# EAGLE design pcb (EAGLE 9.6.2)
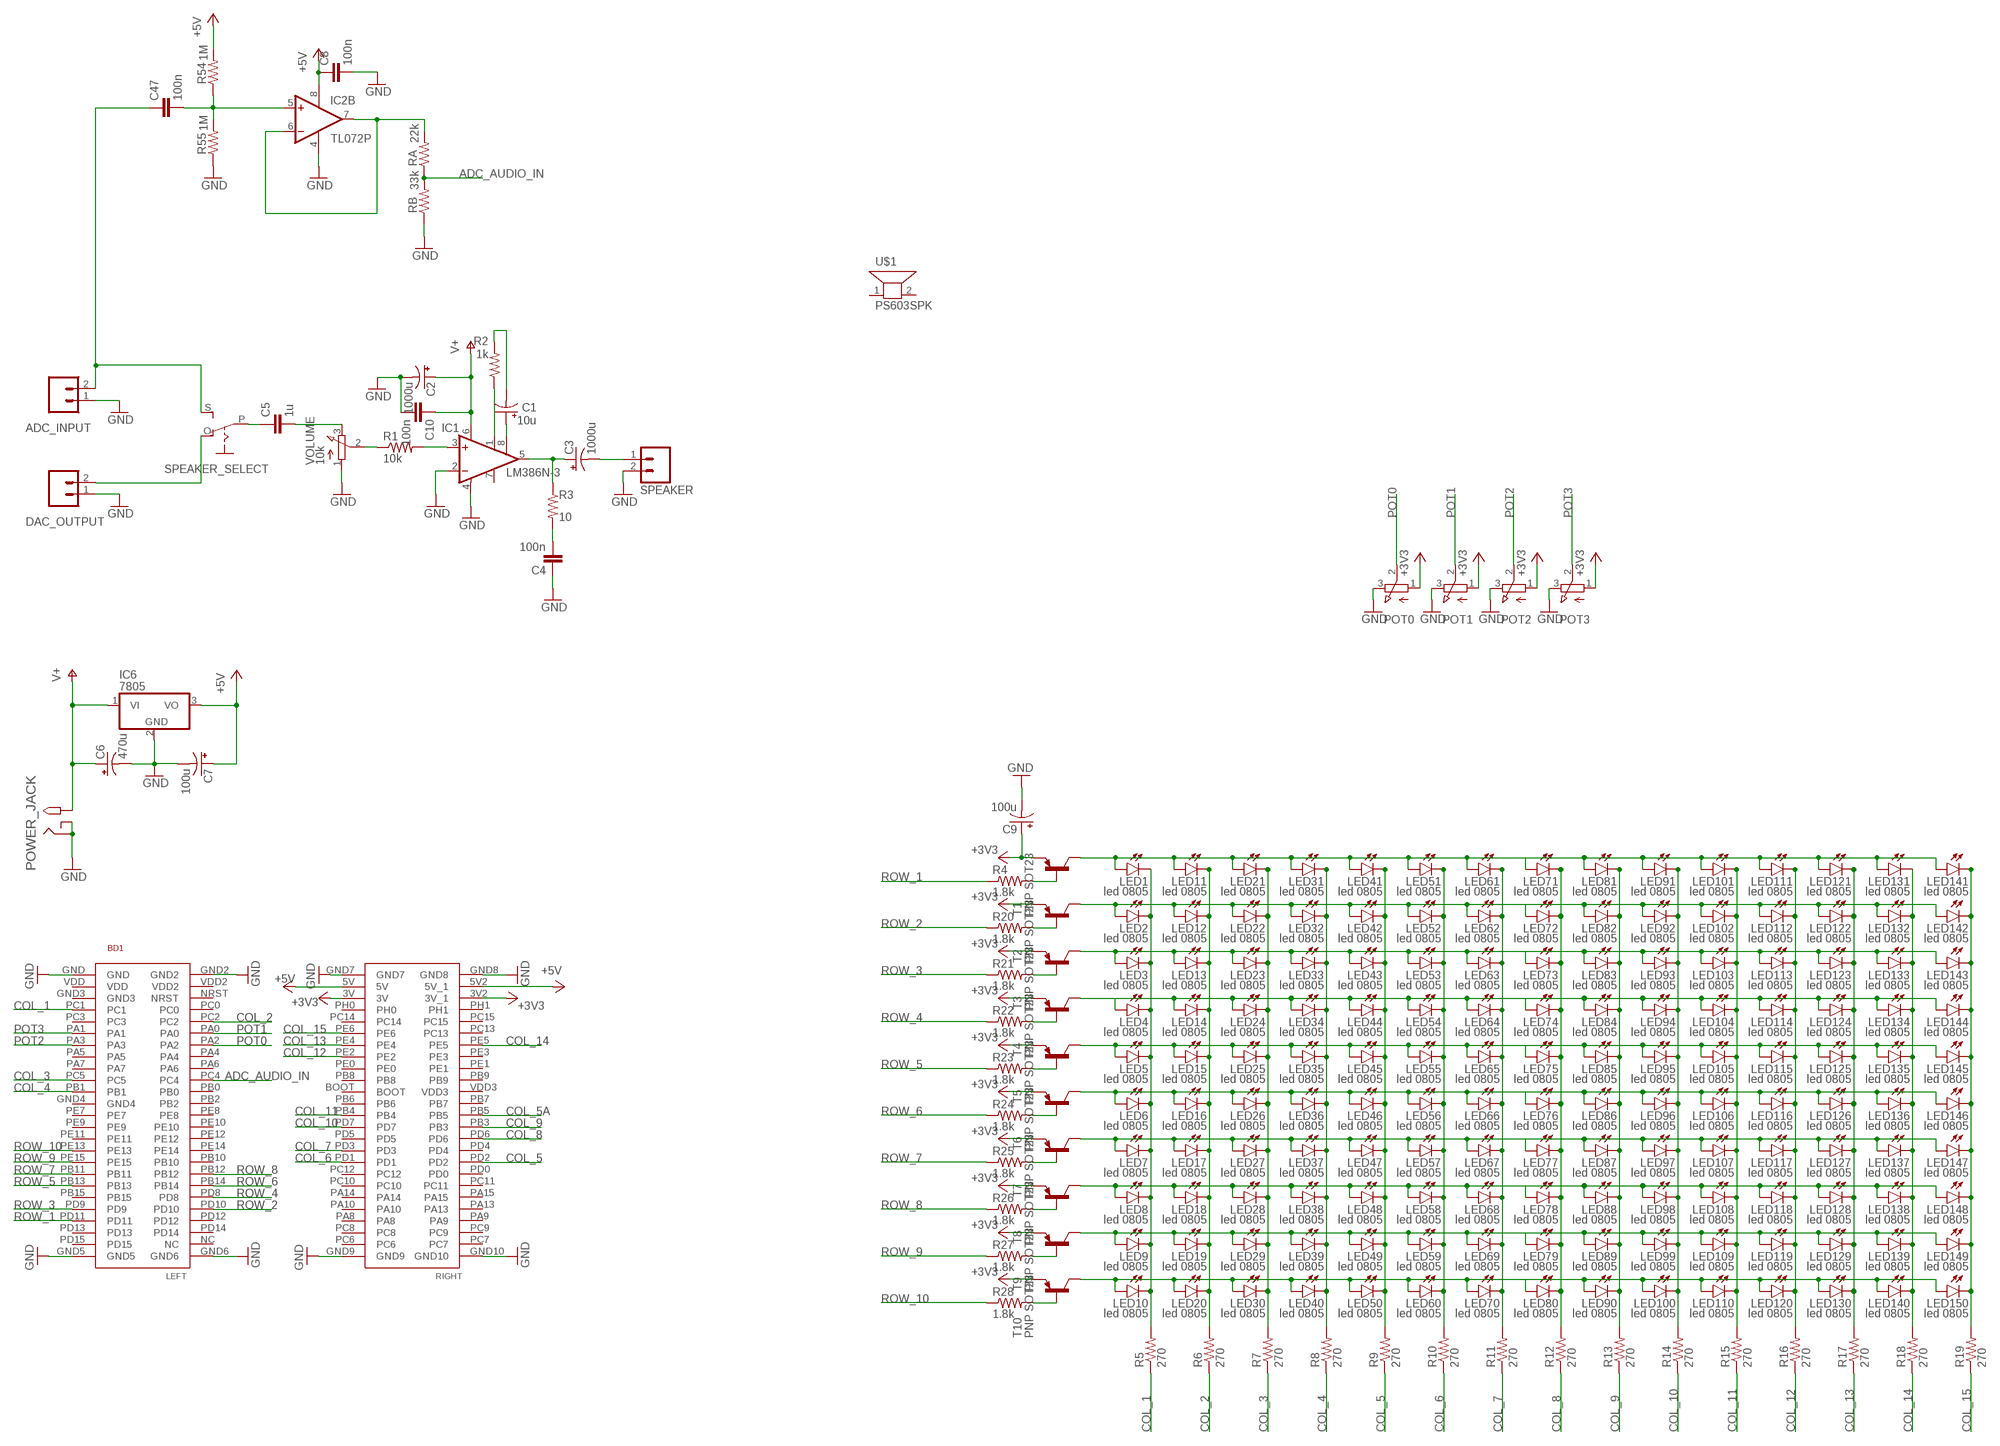
[diagram p0: schematic, sheet 1]

## Parts
ADC_INPUT  M02  [02P]
BD1  STM32F4-DISCOVERY  [STM32F407VG]
C1  10u  CPOL-USE5-6  [E5-6]
C2  1000u  CPOL-USE5-13  [E5-13]
C3  1000u  CPOL-USE5-13  [E5-13]
C4  100n  C5/3.5  [C5B3.5]
C5  1u  C-EU050-035X075  [C050-035X075]
C6  470u  CPOL-USE5-6  [E5-6]
C7  100u  CPOL-USE5-6  [E5-6]
C8  100n  C-EUC0805  [C0805]
C9  100u  CPOL-USE5-6  [E5-6]
C10  100n  C-EUC0805  [C0805]
C47  100n  C5/3.5  [C5B3.5]
DAC_OUTPUT  M02  [02P]
IC1  LM386N-3  [DIL08]
IC2  TL072P  [DIL08]
IC6  7805  7805T  [TO220H]
LED1  led 0805  LEDCHIPLED_0805  [CHIPLED_0805]
LED2  led 0805  LEDCHIPLED_0805  [CHIPLED_0805]
LED3  led 0805  LEDCHIPLED_0805  [CHIPLED_0805]
LED4  led 0805  LEDCHIPLED_0805  [CHIPLED_0805]
LED5  led 0805  LEDCHIPLED_0805  [CHIPLED_0805]
LED6  led 0805  LEDCHIPLED_0805  [CHIPLED_0805]
LED7  led 0805  LEDCHIPLED_0805  [CHIPLED_0805]
LED8  led 0805  LEDCHIPLED_0805  [CHIPLED_0805]
LED9  led 0805  LEDCHIPLED_0805  [CHIPLED_0805]
LED10  led 0805  LEDCHIPLED_0805  [CHIPLED_0805]
LED11  led 0805  LEDCHIPLED_0805  [CHIPLED_0805]
LED12  led 0805  LEDCHIPLED_0805  [CHIPLED_0805]
LED13  led 0805  LEDCHIPLED_0805  [CHIPLED_0805]
LED14  led 0805  LEDCHIPLED_0805  [CHIPLED_0805]
LED15  led 0805  LEDCHIPLED_0805  [CHIPLED_0805]
LED16  led 0805  LEDCHIPLED_0805  [CHIPLED_0805]
LED17  led 0805  LEDCHIPLED_0805  [CHIPLED_0805]
LED18  led 0805  LEDCHIPLED_0805  [CHIPLED_0805]
LED19  led 0805  LEDCHIPLED_0805  [CHIPLED_0805]
LED20  led 0805  LEDCHIPLED_0805  [CHIPLED_0805]
LED21  led 0805  LEDCHIPLED_0805  [CHIPLED_0805]
LED22  led 0805  LEDCHIPLED_0805  [CHIPLED_0805]
LED23  led 0805  LEDCHIPLED_0805  [CHIPLED_0805]
LED24  led 0805  LEDCHIPLED_0805  [CHIPLED_0805]
LED25  led 0805  LEDCHIPLED_0805  [CHIPLED_0805]
LED26  led 0805  LEDCHIPLED_0805  [CHIPLED_0805]
LED27  led 0805  LEDCHIPLED_0805  [CHIPLED_0805]
LED28  led 0805  LEDCHIPLED_0805  [CHIPLED_0805]
LED29  led 0805  LEDCHIPLED_0805  [CHIPLED_0805]
LED30  led 0805  LEDCHIPLED_0805  [CHIPLED_0805]
LED31  led 0805  LEDCHIPLED_0805  [CHIPLED_0805]
LED32  led 0805  LEDCHIPLED_0805  [CHIPLED_0805]
LED33  led 0805  LEDCHIPLED_0805  [CHIPLED_0805]
LED34  led 0805  LEDCHIPLED_0805  [CHIPLED_0805]
LED35  led 0805  LEDCHIPLED_0805  [CHIPLED_0805]
LED36  led 0805  LEDCHIPLED_0805  [CHIPLED_0805]
LED37  led 0805  LEDCHIPLED_0805  [CHIPLED_0805]
LED38  led 0805  LEDCHIPLED_0805  [CHIPLED_0805]
LED39  led 0805  LEDCHIPLED_0805  [CHIPLED_0805]
LED40  led 0805  LEDCHIPLED_0805  [CHIPLED_0805]
LED41  led 0805  LEDCHIPLED_0805  [CHIPLED_0805]
LED42  led 0805  LEDCHIPLED_0805  [CHIPLED_0805]
LED43  led 0805  LEDCHIPLED_0805  [CHIPLED_0805]
LED44  led 0805  LEDCHIPLED_0805  [CHIPLED_0805]
LED45  led 0805  LEDCHIPLED_0805  [CHIPLED_0805]
LED46  led 0805  LEDCHIPLED_0805  [CHIPLED_0805]
LED47  led 0805  LEDCHIPLED_0805  [CHIPLED_0805]
LED48  led 0805  LEDCHIPLED_0805  [CHIPLED_0805]
LED49  led 0805  LEDCHIPLED_0805  [CHIPLED_0805]
LED50  led 0805  LEDCHIPLED_0805  [CHIPLED_0805]
LED51  led 0805  LEDCHIPLED_0805  [CHIPLED_0805]
LED52  led 0805  LEDCHIPLED_0805  [CHIPLED_0805]
LED53  led 0805  LEDCHIPLED_0805  [CHIPLED_0805]
LED54  led 0805  LEDCHIPLED_0805  [CHIPLED_0805]
LED55  led 0805  LEDCHIPLED_0805  [CHIPLED_0805]
LED56  led 0805  LEDCHIPLED_0805  [CHIPLED_0805]
LED57  led 0805  LEDCHIPLED_0805  [CHIPLED_0805]
LED58  led 0805  LEDCHIPLED_0805  [CHIPLED_0805]
LED59  led 0805  LEDCHIPLED_0805  [CHIPLED_0805]
LED60  led 0805  LEDCHIPLED_0805  [CHIPLED_0805]
LED61  led 0805  LEDCHIPLED_0805  [CHIPLED_0805]
LED62  led 0805  LEDCHIPLED_0805  [CHIPLED_0805]
LED63  led 0805  LEDCHIPLED_0805  [CHIPLED_0805]
LED64  led 0805  LEDCHIPLED_0805  [CHIPLED_0805]
LED65  led 0805  LEDCHIPLED_0805  [CHIPLED_0805]
LED66  led 0805  LEDCHIPLED_0805  [CHIPLED_0805]
LED67  led 0805  LEDCHIPLED_0805  [CHIPLED_0805]
LED68  led 0805  LEDCHIPLED_0805  [CHIPLED_0805]
LED69  led 0805  LEDCHIPLED_0805  [CHIPLED_0805]
LED70  led 0805  LEDCHIPLED_0805  [CHIPLED_0805]
LED71  led 0805  LEDCHIPLED_0805  [CHIPLED_0805]
LED72  led 0805  LEDCHIPLED_0805  [CHIPLED_0805]
LED73  led 0805  LEDCHIPLED_0805  [CHIPLED_0805]
LED74  led 0805  LEDCHIPLED_0805  [CHIPLED_0805]
LED75  led 0805  LEDCHIPLED_0805  [CHIPLED_0805]
LED76  led 0805  LEDCHIPLED_0805  [CHIPLED_0805]
LED77  led 0805  LEDCHIPLED_0805  [CHIPLED_0805]
LED78  led 0805  LEDCHIPLED_0805  [CHIPLED_0805]
LED79  led 0805  LEDCHIPLED_0805  [CHIPLED_0805]
LED80  led 0805  LEDCHIPLED_0805  [CHIPLED_0805]
LED81  led 0805  LEDCHIPLED_0805  [CHIPLED_0805]
LED82  led 0805  LEDCHIPLED_0805  [CHIPLED_0805]
LED83  led 0805  LEDCHIPLED_0805  [CHIPLED_0805]
LED84  led 0805  LEDCHIPLED_0805  [CHIPLED_0805]
LED85  led 0805  LEDCHIPLED_0805  [CHIPLED_0805]
LED86  led 0805  LEDCHIPLED_0805  [CHIPLED_0805]
LED87  led 0805  LEDCHIPLED_0805  [CHIPLED_0805]
LED88  led 0805  LEDCHIPLED_0805  [CHIPLED_0805]
LED89  led 0805  LEDCHIPLED_0805  [CHIPLED_0805]
LED90  led 0805  LEDCHIPLED_0805  [CHIPLED_0805]
LED91  led 0805  LEDCHIPLED_0805  [CHIPLED_0805]
LED92  led 0805  LEDCHIPLED_0805  [CHIPLED_0805]
LED93  led 0805  LEDCHIPLED_0805  [CHIPLED_0805]
LED94  led 0805  LEDCHIPLED_0805  [CHIPLED_0805]
LED95  led 0805  LEDCHIPLED_0805  [CHIPLED_0805]
LED96  led 0805  LEDCHIPLED_0805  [CHIPLED_0805]
LED97  led 0805  LEDCHIPLED_0805  [CHIPLED_0805]
LED98  led 0805  LEDCHIPLED_0805  [CHIPLED_0805]
LED99  led 0805  LEDCHIPLED_0805  [CHIPLED_0805]
LED100  led 0805  LEDCHIPLED_0805  [CHIPLED_0805]
LED101  led 0805  LEDCHIPLED_0805  [CHIPLED_0805]
LED102  led 0805  LEDCHIPLED_0805  [CHIPLED_0805]
LED103  led 0805  LEDCHIPLED_0805  [CHIPLED_0805]
LED104  led 0805  LEDCHIPLED_0805  [CHIPLED_0805]
LED105  led 0805  LEDCHIPLED_0805  [CHIPLED_0805]
LED106  led 0805  LEDCHIPLED_0805  [CHIPLED_0805]
LED107  led 0805  LEDCHIPLED_0805  [CHIPLED_0805]
LED108  led 0805  LEDCHIPLED_0805  [CHIPLED_0805]
LED109  led 0805  LEDCHIPLED_0805  [CHIPLED_0805]
LED110  led 0805  LEDCHIPLED_0805  [CHIPLED_0805]
LED111  led 0805  LEDCHIPLED_0805  [CHIPLED_0805]
LED112  led 0805  LEDCHIPLED_0805  [CHIPLED_0805]
LED113  led 0805  LEDCHIPLED_0805  [CHIPLED_0805]
LED114  led 0805  LEDCHIPLED_0805  [CHIPLED_0805]
LED115  led 0805  LEDCHIPLED_0805  [CHIPLED_0805]
LED116  led 0805  LEDCHIPLED_0805  [CHIPLED_0805]
LED117  led 0805  LEDCHIPLED_0805  [CHIPLED_0805]
LED118  led 0805  LEDCHIPLED_0805  [CHIPLED_0805]
LED119  led 0805  LEDCHIPLED_0805  [CHIPLED_0805]
LED120  led 0805  LEDCHIPLED_0805  [CHIPLED_0805]
LED121  led 0805  LEDCHIPLED_0805  [CHIPLED_0805]
LED122  led 0805  LEDCHIPLED_0805  [CHIPLED_0805]
LED123  led 0805  LEDCHIPLED_0805  [CHIPLED_0805]
LED124  led 0805  LEDCHIPLED_0805  [CHIPLED_0805]
LED125  led 0805  LEDCHIPLED_0805  [CHIPLED_0805]
LED126  led 0805  LEDCHIPLED_0805  [CHIPLED_0805]
LED127  led 0805  LEDCHIPLED_0805  [CHIPLED_0805]
LED128  led 0805  LEDCHIPLED_0805  [CHIPLED_0805]
LED129  led 0805  LEDCHIPLED_0805  [CHIPLED_0805]
LED130  led 0805  LEDCHIPLED_0805  [CHIPLED_0805]
LED131  led 0805  LEDCHIPLED_0805  [CHIPLED_0805]
LED132  led 0805  LEDCHIPLED_0805  [CHIPLED_0805]
LED133  led 0805  LEDCHIPLED_0805  [CHIPLED_0805]
LED134  led 0805  LEDCHIPLED_0805  [CHIPLED_0805]
LED135  led 0805  LEDCHIPLED_0805  [CHIPLED_0805]
LED136  led 0805  LEDCHIPLED_0805  [CHIPLED_0805]
LED137  led 0805  LEDCHIPLED_0805  [CHIPLED_0805]
LED138  led 0805  LEDCHIPLED_0805  [CHIPLED_0805]
LED139  led 0805  LEDCHIPLED_0805  [CHIPLED_0805]
LED140  led 0805  LEDCHIPLED_0805  [CHIPLED_0805]
LED141  led 0805  LEDCHIPLED_0805  [CHIPLED_0805]
LED142  led 0805  LEDCHIPLED_0805  [CHIPLED_0805]
LED143  led 0805  LEDCHIPLED_0805  [CHIPLED_0805]
LED144  led 0805  LEDCHIPLED_0805  [CHIPLED_0805]
LED145  led 0805  LEDCHIPLED_0805  [CHIPLED_0805]
LED146  led 0805  LEDCHIPLED_0805  [CHIPLED_0805]
LED147  led 0805  LEDCHIPLED_0805  [CHIPLED_0805]
LED148  led 0805  LEDCHIPLED_0805  [CHIPLED_0805]
LED149  led 0805  LEDCHIPLED_0805  [CHIPLED_0805]
LED150  led 0805  LEDCHIPLED_0805  [CHIPLED_0805]
POT0  3RP/1610N  [3RP/1610N]
POT1  3RP/1610N  [3RP/1610N]
POT2  3RP/1610N  [3RP/1610N]
POT3  3RP/1610N  [3RP/1610N]
POWER_JACK  2.1MMJACKTHM  [PJ-102A]
R1  10k  R-US_0207/10  [0207/10]
R2  1k  R-US_0207/10  [0207/10]
R3  10  R-US_0207/10  [0207/10]
R4  1.8k  R-US_R0805  [R0805]
R5  270  R-US_R0805  [R0805]
R6  270  R-US_R0805  [R0805]
R7  270  R-US_R0805  [R0805]
R8  270  R-US_R0805  [R0805]
R9  270  R-US_R0805  [R0805]
R10  270  R-US_R0805  [R0805]
R11  270  R-US_R0805  [R0805]
R12  270  R-US_R0805  [R0805]
R13  270  R-US_R0805  [R0805]
R14  270  R-US_R0805  [R0805]
R15  270  R-US_R0805  [R0805]
R16  270  R-US_R0805  [R0805]
R17  270  R-US_R0805  [R0805]
R18  270  R-US_R0805  [R0805]
R19  270  R-US_R0805  [R0805]
R20  1.8k  R-US_R0805  [R0805]
R21  1.8k  R-US_R0805  [R0805]
R22  1.8k  R-US_R0805  [R0805]
R23  1.8k  R-US_R0805  [R0805]
R24  1.8k  R-US_R0805  [R0805]
R25  1.8k  R-US_R0805  [R0805]
R26  1.8k  R-US_R0805  [R0805]
R27  1.8k  R-US_R0805  [R0805]
R28  1.8k  R-US_R0805  [R0805]
R54  1M  R-US_0207/10  [0207/10]
R55  1M  R-US_0207/10  [0207/10]
RA  22k  R-US_0207/10  [0207/10]
RB  33k  R-US_0207/10  [0207/10]
SPEAKER  M02  [02P]
SPEAKER_SELECT  EG1218S  [EG1218]
T1  PNP SOT23  BC856BLT1-PNP-SOT23-BEC  [SOT23-BEC]
T2  PNP SOT23  BC856BLT1-PNP-SOT23-BEC  [SOT23-BEC]
T3  PNP SOT23  BC856BLT1-PNP-SOT23-BEC  [SOT23-BEC]
T4  PNP SOT23  BC856BLT1-PNP-SOT23-BEC  [SOT23-BEC]
T5  PNP SOT23  BC856BLT1-PNP-SOT23-BEC  [SOT23-BEC]
T6  PNP SOT23  BC856BLT1-PNP-SOT23-BEC  [SOT23-BEC]
T7  PNP SOT23  BC856BLT1-PNP-SOT23-BEC  [SOT23-BEC]
T8  PNP SOT23  BC856BLT1-PNP-SOT23-BEC  [SOT23-BEC]
T9  PNP SOT23  BC856BLT1-PNP-SOT23-BEC  [SOT23-BEC]
T10  PNP SOT23  BC856BLT1-PNP-SOT23-BEC  [SOT23-BEC]
U$1  PS603SPK  [PS603]
VOLUME  10k  3RP/1610N  [3RP/1610N]

## Nets
+3V3: BD1.3V BD1.3V2(3V_1) C9.+ POT0.1(A) POT1.1(A) POT2.1(A) POT3.1(A) T1.E T2.E T3.E T4.E T5.E T6.E T7.E T8.E T9.E T10.E
+5V: BD1.5V BD1.5V2(5V_1) C7.+ C8.1 IC2.8(P:V+) IC6.3(VO) R54.2
ADC_AUDIO_IN: BD1.PC4 RA.1 RB.2
COL_1: BD1.PC1 R5.1
COL_2: BD1.PC2 R6.1
COL_3: BD1.PC5 R7.1
COL_4: BD1.PB1 R8.1
COL_5: BD1.PD2 R9.1
COL_5A: BD1.PB5
COL_6: BD1.PD1 R10.1
COL_7: BD1.PD3 R11.1
COL_8: BD1.PD6 R12.1
COL_9: BD1.PB3 R13.1
COL_10: BD1.PD7 R14.1
COL_11: BD1.PB4 R15.1
COL_12: BD1.PE2 R16.1
COL_13: BD1.PE4 R17.1
COL_14: BD1.PE5 R18.1
COL_15: BD1.PE6 R19.1
GND: ADC_INPUT.1 BD1.GND BD1.GND2 BD1.GND5 BD1.GND6 BD1.GND7 BD1.GND8 BD1.GND9 BD1.GND10 C2.- C4.1 C6.- C7.- C8.2 C9.- C10.2 DAC_OUTPUT.1 IC1.2(-IN) IC1.4(GND) IC2.4(P:V-) IC6.2(GND) POT0.3(E) POT1.3(E) POT2.3(E) POT3.3(E) POWER_JACK.RING POWER_JACK.RING_SW R55.1 RB.1 SPEAKER.2 VOLUME.1(A)
GUITAR_BUFFER: IC2.6(B:-IN) IC2.7(B:OUT) RA.2
N$1: LED1.C LED2.C LED3.C LED4.C LED5.C LED6.C LED7.C LED8.C LED9.C LED10.C R5.2
N$2: C5.2 VOLUME.3(E)
N$3: LED11.C LED12.C LED13.C LED14.C LED15.C LED16.C LED17.C LED18.C LED19.C LED20.C R6.2
N$4: LED21.C LED22.C LED23.C LED24.C LED25.C LED26.C LED27.C LED28.C LED29.C LED30.C R7.2
N$5: LED31.C LED32.C LED33.C LED34.C LED35.C LED36.C LED37.C LED38.C LED39.C LED40.C R8.2
N$6: LED41.C LED42.C LED43.C LED44.C LED45.C LED46.C LED47.C LED48.C LED49.C LED50.C R9.2
N$7: LED51.C LED52.C LED53.C LED54.C LED55.C LED56.C LED57.C LED58.C LED59.C LED60.C R10.2
N$8: LED61.C LED62.C LED63.C LED64.C LED65.C LED66.C LED67.C LED68.C LED69.C LED70.C R11.2
N$9: LED71.C LED72.C LED73.C LED74.C LED75.C LED76.C LED77.C LED78.C LED79.C LED80.C R12.2
N$10: LED81.C LED82.C LED83.C LED84.C LED85.C LED86.C LED87.C LED88.C LED89.C LED90.C R13.2
N$11: LED91.C LED92.C LED93.C LED94.C LED95.C LED96.C LED97.C LED98.C LED99.C LED100.C R14.2
N$12: LED101.C LED102.C LED103.C LED104.C LED105.C LED106.C LED107.C LED108.C LED109.C LED110.C R15.2
N$13: LED111.C LED112.C LED113.C LED114.C LED115.C LED116.C LED117.C LED118.C LED119.C LED120.C R16.2
N$14: LED121.C LED122.C LED123.C LED124.C LED125.C LED126.C LED127.C LED128.C LED129.C LED130.C R17.2
N$15: LED131.C LED132.C LED133.C LED134.C LED135.C LED136.C LED137.C LED138.C LED139.C LED140.C R18.2
N$16: LED141.C LED142.C LED143.C LED144.C LED145.C LED146.C LED147.C LED148.C LED149.C LED150.C R19.2
N$17: LED1.A LED11.A LED21.A LED31.A LED41.A LED51.A LED61.A LED71.A LED81.A LED91.A LED101.A LED111.A LED121.A LED131.A LED141.A T1.C
N$19: R25.2 T7.B
N$22: R26.2 T8.B
N$23: LED7.A LED17.A LED27.A LED37.A LED47.A LED57.A LED67.A LED77.A LED87.A LED97.A LED107.A LED117.A LED127.A LED137.A LED147.A T7.C
N$24: LED8.A LED18.A LED28.A LED38.A LED48.A LED58.A LED68.A LED78.A LED88.A LED98.A LED108.A LED118.A LED128.A LED138.A LED148.A T8.C
N$25: LED9.A LED19.A LED29.A LED39.A LED49.A LED59.A LED69.A LED79.A LED89.A LED99.A LED109.A LED119.A LED129.A LED139.A LED149.A T9.C
N$26: LED10.A LED20.A LED30.A LED40.A LED50.A LED60.A LED70.A LED80.A LED90.A LED100.A LED110.A LED120.A LED130.A LED140.A LED150.A T10.C
N$27: ADC_INPUT.2 C47.1 SPEAKER_SELECT.S
N$28: DAC_OUTPUT.2 SPEAKER_SELECT.O
N$29: R1.1 VOLUME.2(S)
N$30: IC1.3(+IN) R1.2
N$31: C1.+ IC1.8(GAIN)
N$32: IC1.1(GAIN) R2.1
N$33: C1.- R2.2
N$34: C3.+ IC1.5(OUT) R3.1
N$35: C3.- SPEAKER.1
N$36: C4.2 R3.2
N$37: C5.1 SPEAKER_SELECT.P
N$40: R4.2 T1.B
N$42: LED2.A LED12.A LED22.A LED32.A LED42.A LED52.A LED62.A LED72.A LED82.A LED92.A LED102.A LED112.A LED122.A LED132.A LED142.A T2.C
N$43: R20.2 T2.B
N$45: LED3.A LED13.A LED23.A LED33.A LED43.A LED53.A LED63.A LED73.A LED83.A LED93.A LED103.A LED113.A LED123.A LED133.A LED143.A T3.C
N$46: R21.2 T3.B
N$48: LED4.A LED14.A LED24.A LED34.A LED44.A LED54.A LED64.A LED74.A LED84.A LED94.A LED104.A LED114.A LED124.A LED134.A LED144.A T4.C
N$49: R22.2 T4.B
N$51: LED5.A LED15.A LED25.A LED35.A LED45.A LED55.A LED65.A LED75.A LED85.A LED95.A LED105.A LED115.A LED125.A LED135.A LED145.A T5.C
N$52: R23.2 T5.B
N$54: LED6.A LED16.A LED26.A LED36.A LED46.A LED56.A LED66.A LED76.A LED86.A LED96.A LED106.A LED116.A LED126.A LED136.A LED146.A T6.C
N$55: R24.2 T6.B
N$59: R27.2 T9.B
N$62: R28.2 T10.B
N$77: C47.2 IC2.5(B:+IN) R54.1 R55.2
POT0: BD1.PA2 POT0.2(S)
POT1: BD1.PA0 POT1.2(S)
POT2: BD1.PA3 POT2.2(S)
POT3: BD1.PA1 POT3.2(S)
ROW_1: BD1.PD11 R4.1
ROW_2: BD1.PD10 R20.1
ROW_3: BD1.PD9 R21.1
ROW_4: BD1.PD8 R22.1
ROW_5: BD1.PB13 R23.1
ROW_6: BD1.PB14 R24.1
ROW_7: BD1.PB11 R25.1
ROW_8: BD1.PB12 R26.1
ROW_9: BD1.PE15 R27.1
ROW_10: BD1.PE13 R28.1
V+: C2.+ C6.+ C10.1 IC1.6(VS) IC6.1(VI) POWER_JACK.TIP
Unconnected: BD1.BOOT BD1.GND3 BD1.GND4 BD1.NC BD1.NRST BD1.PA4 BD1.PA5 BD1.PA6 BD1.PA7 BD1.PA8 BD1.PA9 BD1.PA10 BD1.PA13 BD1.PA14 BD1.PA15 BD1.PB0 BD1.PB2 BD1.PB6 BD1.PB7 BD1.PB8 BD1.PB9 BD1.PB10 BD1.PB15 BD1.PC0 BD1.PC3 BD1.PC6 BD1.PC7 BD1.PC8 BD1.PC9 BD1.PC10 BD1.PC11 BD1.PC12 BD1.PC13 BD1.PC14 BD1.PC15 BD1.PD0 BD1.PD4 BD1.PD5 BD1.PD12 BD1.PD13 BD1.PD14 BD1.PD15 BD1.PE0 BD1.PE1 BD1.PE3 BD1.PE7 BD1.PE8 BD1.PE9 BD1.PE10 BD1.PE11 BD1.PE12 BD1.PE14 BD1.PH0 BD1.PH1 BD1.VDD BD1.VDD2 BD1.VDD3 IC1.7(BYPASS) IC2.1(A:OUT) IC2.2(A:-IN) IC2.3(A:+IN) U$1.1 U$1.2

## Library data of the parts
ADC_INPUT DAC_OUTPUT SPEAKER = con-amp-quick:M02: AMP QUICK CONNECTOR; OC_FARNELL: unknown; OC_NEWARK: unknown
BD1 = STM32F4 DISCOVERY:STM32F4-DISCOVERY: STM32F4DISCOVERY STM32F407VG Create by Jairo Reyes Email: jairo.314@hotmail.com
C1-C3 C6 C7 C9 = rcl:CPOL-US: POLARIZED CAPACITOR, American symbol; SPICEPREFIX: C
C4 C47 = capacitor-wima:C: CAPACITOR naming: grid - package width
C5 C8 C10 = rcl:C-EU: CAPACITOR, European symbol; SPICEPREFIX: C
IC1 = linear:LM386?-*: Low Voltage Audio Power Amplifier Source: http://cache.national.com/ds/LM/LM386.pdf
IC2 = linear:TL072: OP AMP
IC6 = linear:78*: Positive VOLTAGE REGULATOR Source: http://cache.national.com/ds/LM/LM78L05.pdf http://www.fairchildsemi.com/ds/LM/LM7805.pdf
LED1-LED150 = led:LED: LED OSRAM: - CHIPLED LG R971, LG N971, LY N971, LG Q971, LY Q971, LO R971, LY R971 LH N974, LH R974 LS Q976, LO Q976, LY Q976 LO Q996 - Hyper CHIPLED LW Q18S LB Q993, LB Q99A, LB R99A - SideLED LS A670, LO A670, LY A670, LG A670, LP A670 LB A673, LV A673, LT A673, LW A673 LH A674 LY A675 LS A676, LA A676, LO A676, LY A676, LW A676 LS A679, LY A679, LG A679 - Hyper Micro SIDELED® LS Y876, LA Y876, LO Y876, LY Y876 LT Y87S - SmartLED LW L88C, LW L88S LB L89C, LB L89S, LG L890 LS L89K, LO L89K, LY L89K LS L896, LA L896, LO L896, LY L896 - TOPLED LS T670, LO T670, LY T670, LG T670, LP T670 LSG T670, LSP T670, LSY T670, LOP T670, LYG T670 LG T671, LOG T671, LSG T671 LB T673, LV T673, LT T673, LW T673 LH T674 LS T676, LA T676, LO T676, LY T676, LB T676, LH T676, LSB T676, LW T676 LB T67C, LV T67C, LT T67C, LS T67K, LO T67K, LY T67K, LW E67C LS E67B, LA E67B, LO E67B, LY E67B, LB E67C, LV E67C, LT E67C LW T67C LS T679, LY T679, LG T679 LS T770, LO T770, LY T770, LG T770, LP T770 LB T773, LV T773, LT T773, LW T773 LH T774 LS E675, LA E675, LY E675, LS T675 LS T776, LA T776, LO T776, LY T776, LB T776 LHGB T686 LT T68C, LB T68C - Hyper Mini TOPLED® LB M676 - Mini TOPLED Santana® LG M470 LS M47K, LO M47K, LY M47K Source: http://www.osram.convergy.de LUXEON: - LUMILED® LXK2-PW12-R00, LXK2-PW12-S00, LXK2-PW14-U00, LXK2-PW14-V00 LXK2-PM12-R00, LXK2-PM12-S00, LXK2-PM14-U00 LXK2-PE12-Q00, LXK2-PE12-R00, LXK2-PE12-S00, LXK2-PE14-T00, LXK2-PE14-U00 LXK2-PB12-K00, LXK2-PB12-L00, LXK2-PB12-M00, LXK2-PB14-N00, LXK2-PB14-P00, LXK2-PB14-Q00 LXK2-PR12-L00, LXK2-PR12-M00, LXK2-PR14-Q00, LXK2-PR14-R00 LXK2-PD12-Q00, LXK2-PD12-R00, LXK2-PD12-S00 LXK2-PH12-R00, LXK2-PH12-S00 LXK2-PL12-P00, LXK2-PL12-Q00, LXK2-PL12-R00 Source: www.luxeon.com KINGBRIGHT: KA-3528ASYC Source: www.kingbright.com
POT0 POT1-POT3 VOLUME = pot:3RP/1610N: 16mm Potentiometer one level Source: http://www.alphapotentiometers.net/html/16mm_pot_2.html
POWER_JACK = adafruit:2.1MMJACK: 2.1mm x 5.5mm THM DC jack with internal switch. Digikey part #PJ-102A, 4UCON part #05537 2.1mm x 5.5mm SMT DC jack with internal switch. Digikey part #PJ-002A-SMT, 4UCON part #03267 By microbuilder.eu & adafruit.com
R1-R28 R54 R55 RA RB = rcl:R-US_: RESISTOR, American symbol; SPICEPREFIX: R
SPEAKER_SELECT = adafruit:EG1218: SLIDING SWITCH 0.1" spacing through hole, vertical SPDT slide switch http://www.ladyada.net/library/pcb/eaglelibrary.html
T1-T10 = transistor:*-PNP-: PNP Transistror
U$1 = adafruit:PS603: PS603 Small 8 ohm speaker, from Mouser. Can SMT solder to board http://www.ladyada.net/library/pcb/eaglelibrary.html

## Board
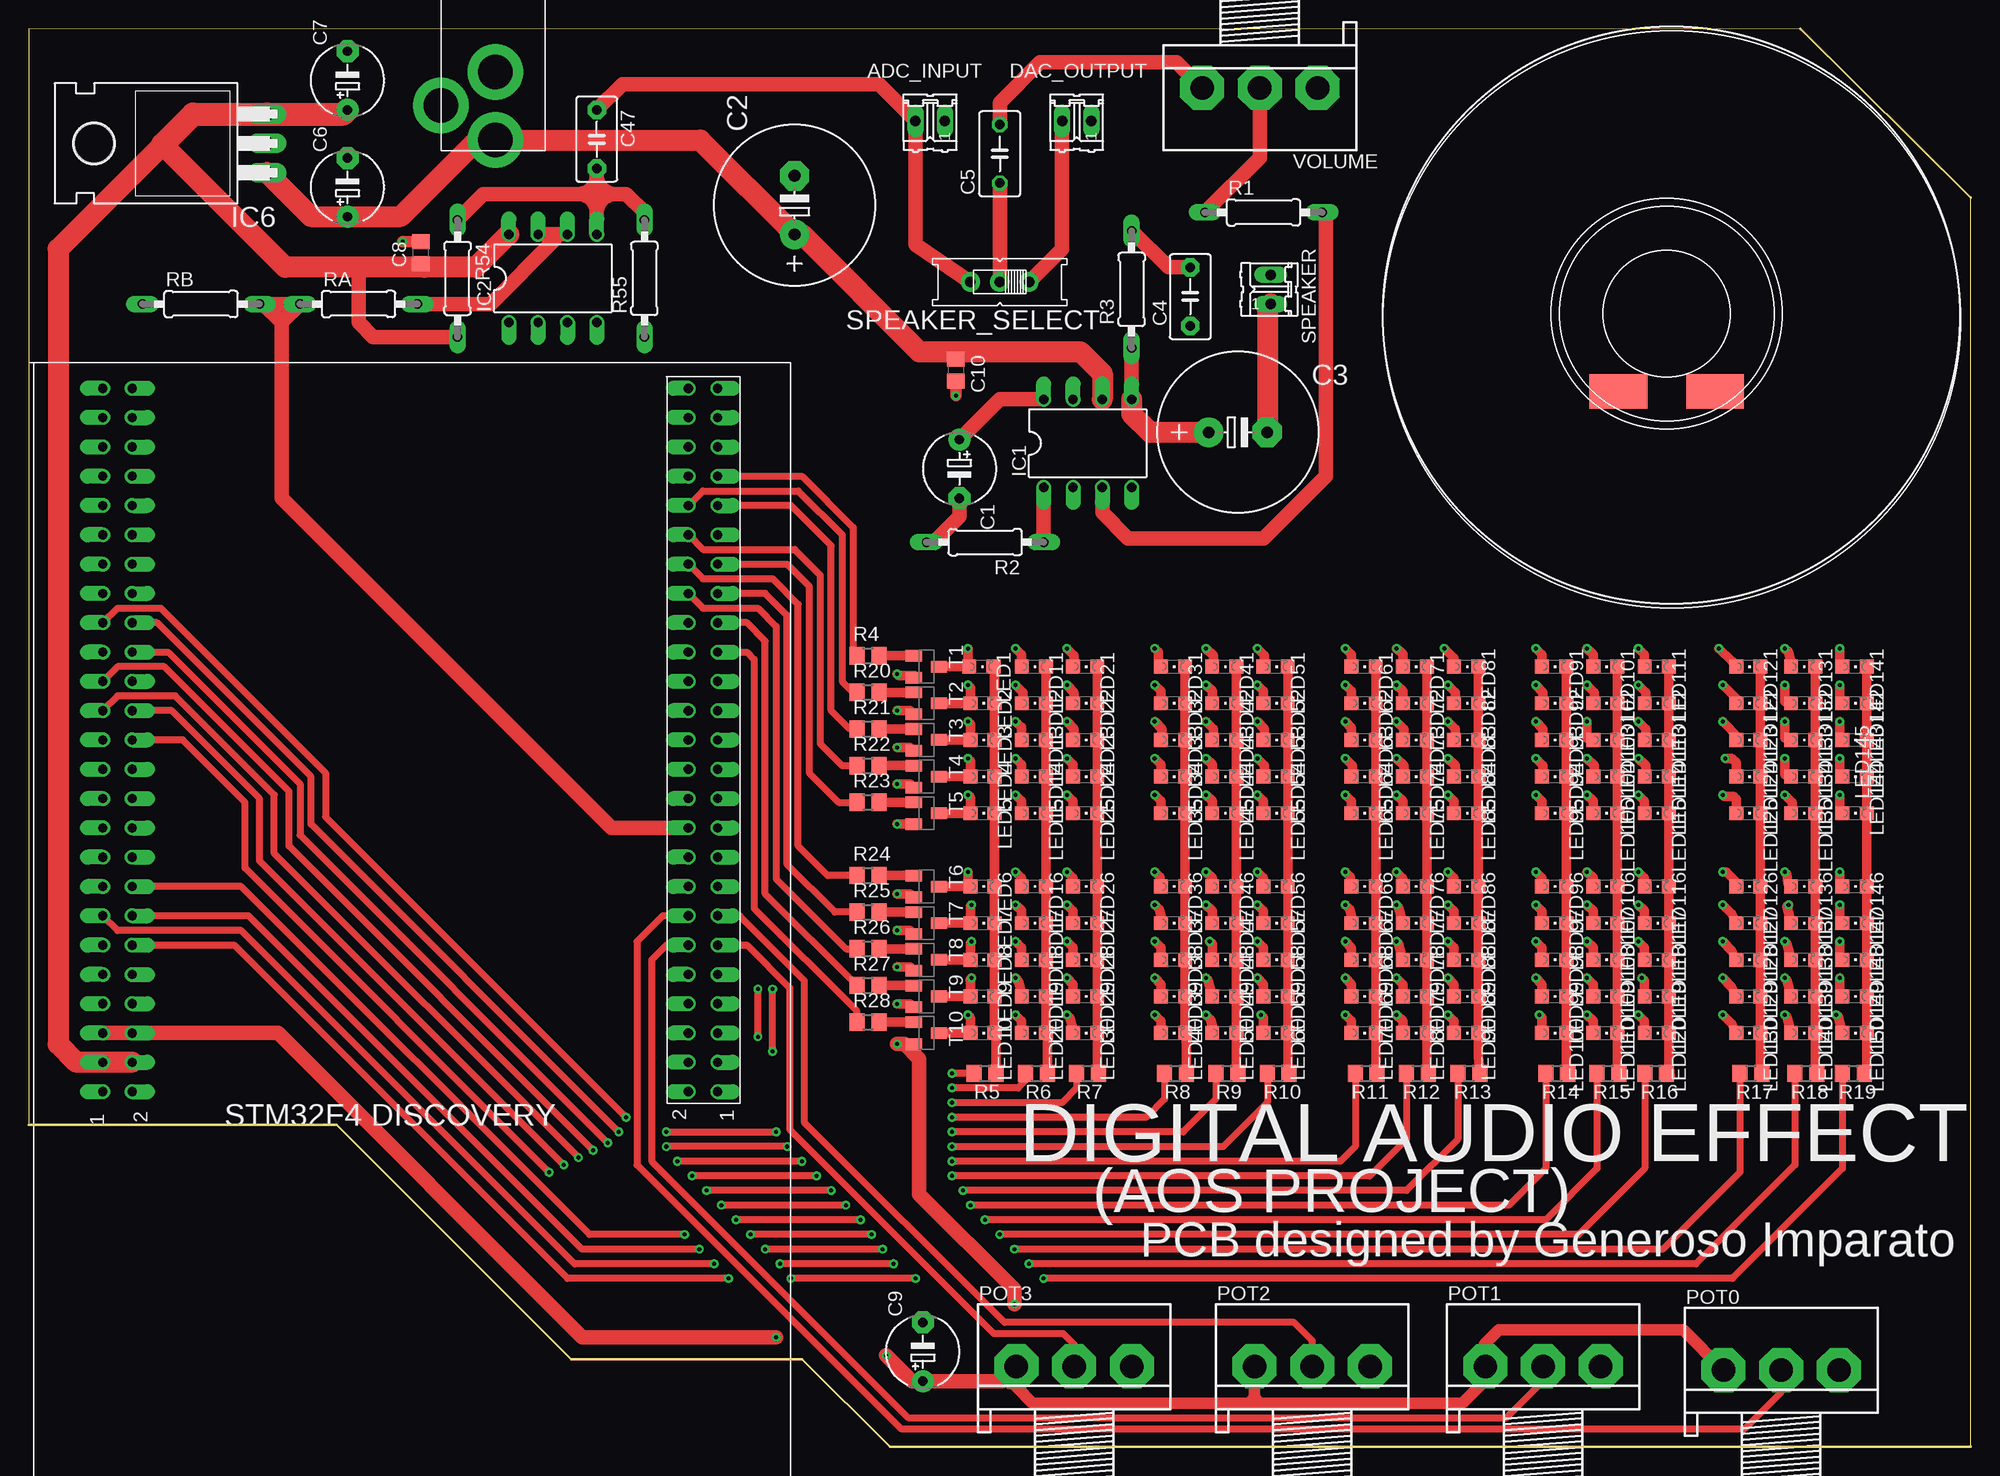
[diagram p1: board, top side]
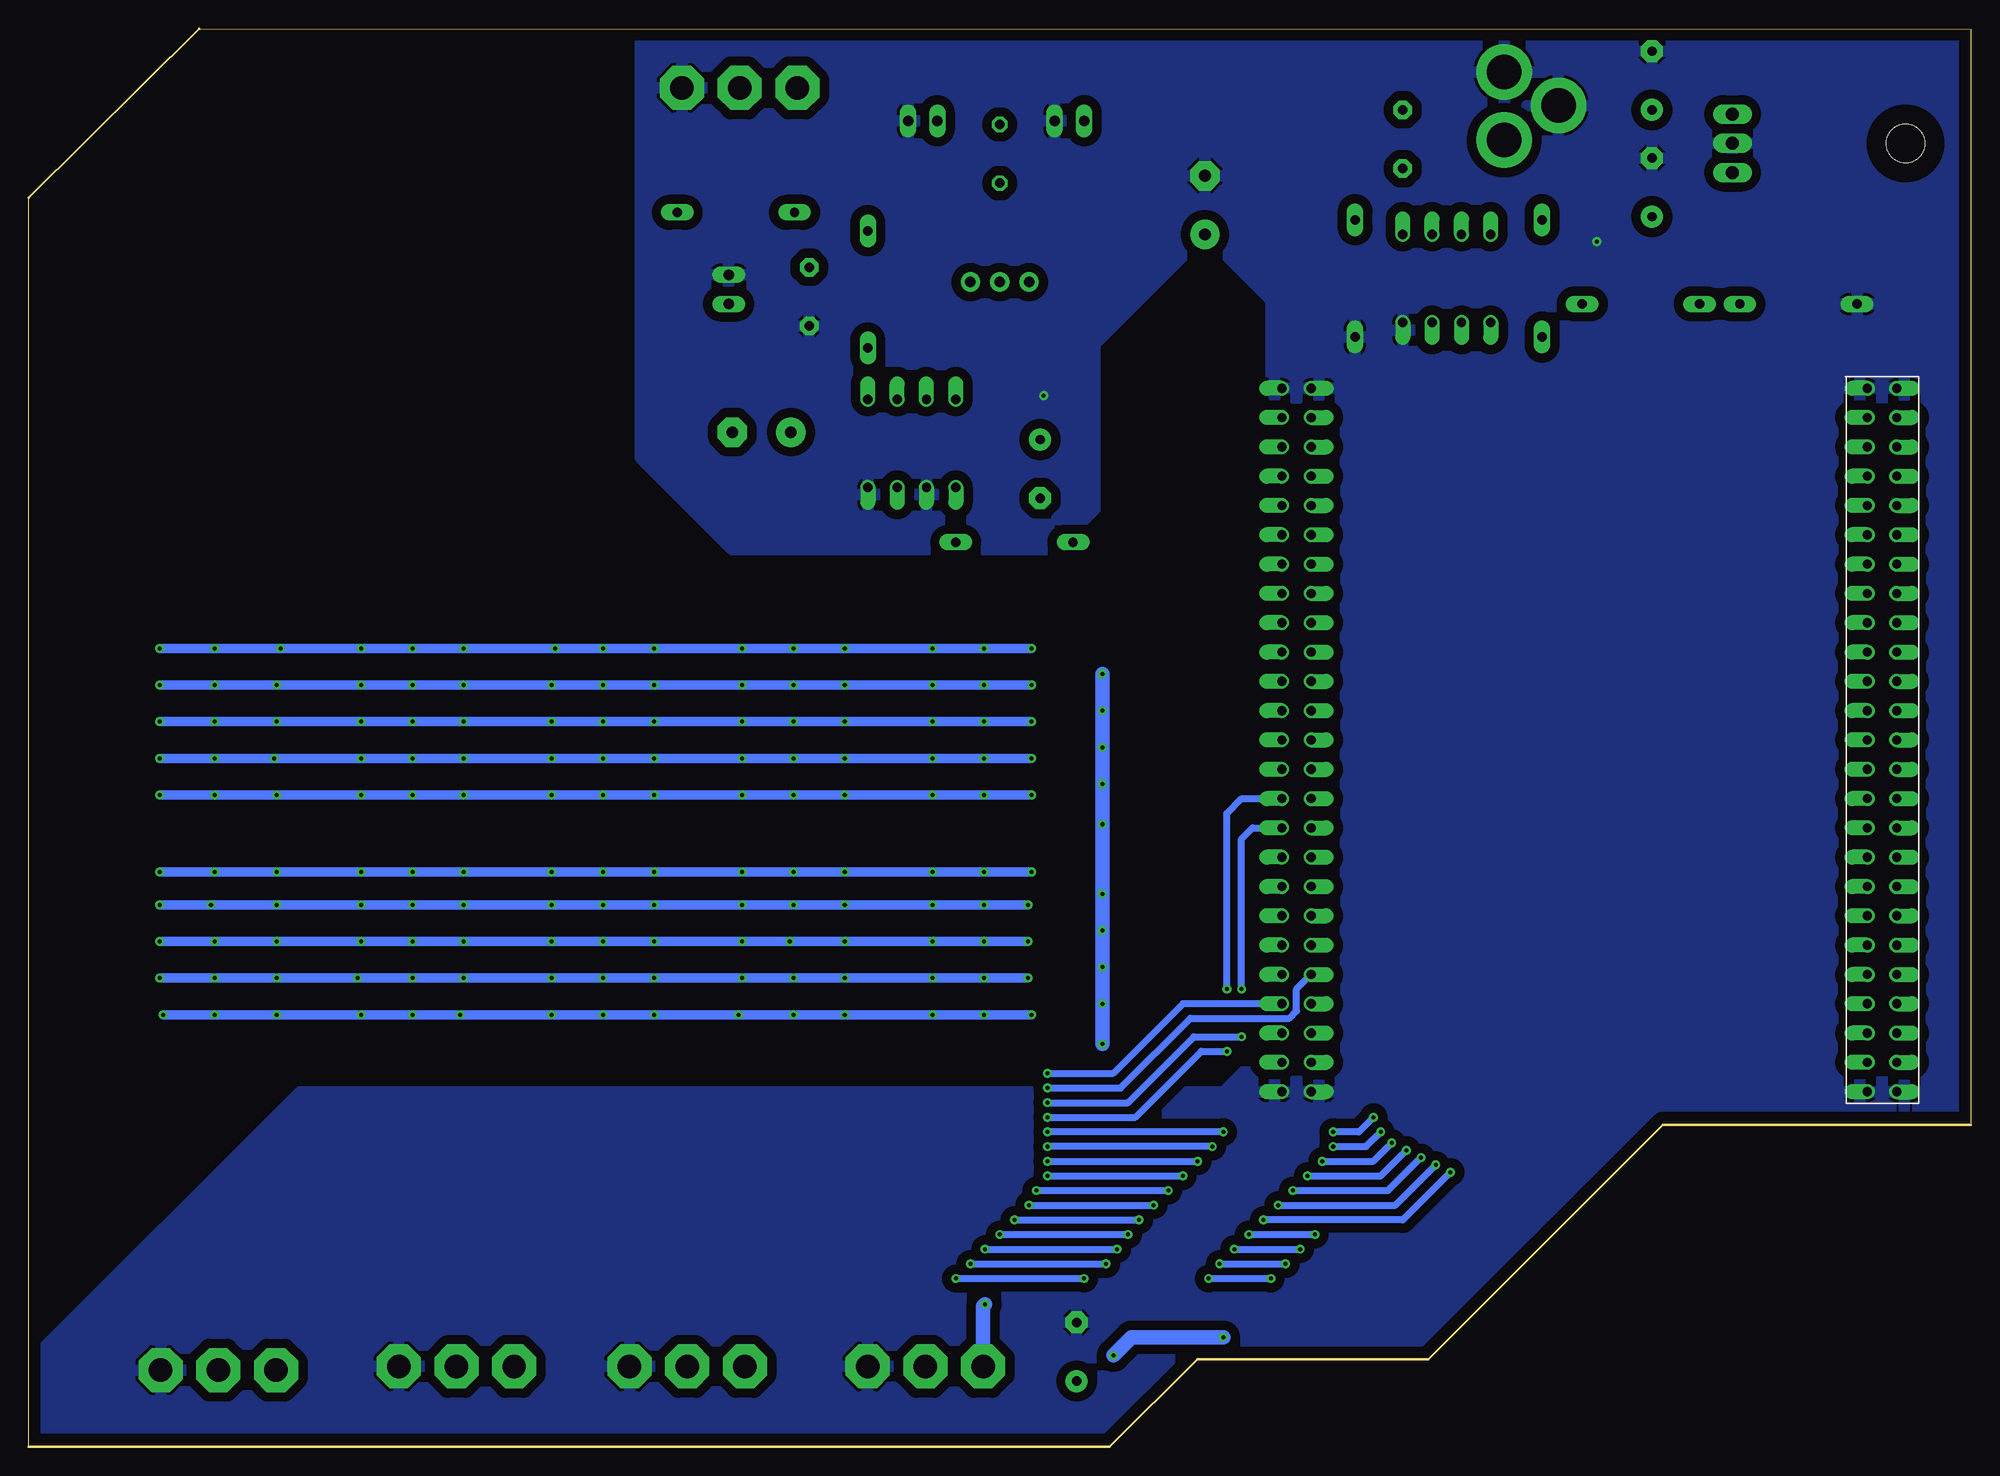
[diagram p2: board, bottom side, seen from below]

Size 168.28 x 122.91 mm. Coordinates in mm from the lower left corner, seen from the top.
Outline: 168.28,0 168.28,108.27 153.53,122.91 0,122.87 0,27.94 26.67,27.94 46.99,7.62 66.99,7.62 74.61,0 168.28,0
Copper layers (1*16): Top 0.035mm / dielectric 1.5mm / Bottom 0.035mm
Design rules "default": minimum track width 6mil, minimum drill 0.35mm, track to track 6mil, track to pad 6mil, pad to pad 6mil, via to via 6mil, smd to smd 6mil, copper to edge 40mil, drill to drill 6mil, minimum pad ring 10mil, minimum via ring 8mil, stop-mask expansion 4mil, vias tented up to drill 0mil, thermal gap 10mil

### Footprints (pad centres in the part's own frame; a part is rotated, then mirrored left to right if it is on the bottom)
02P = drill 0.914 long: 1 -1.27,0; 2 1.27,0
STM32F407VG = drill 0.8 pad 1.27 offset: 3V 50.74,55.88; 3V2 53.28,55.88; 5V 50.74,58.42; 5V2 53.28,58.42; BOOT 50.74,35.56; GND 0,60.96; GND2 2.54,60.96; GND3 0,55.88; GND4 0,33.02; GND5 0,0; GND6 2.54,0; GND7 50.74,60.96; GND8 53.28,60.96; GND9 50.74,0; GND10 53.28,0; NC 2.54,2.54; NRST 2.54,55.88; PA0 2.54,48.26; PA1 0,48.26; PA2 2.54,45.72; PA3 0,45.72; PA4 2.54,43.18; PA5 0,43.18; PA6 2.54,40.64; PA7 0,40.64; PA8 50.74,7.62; PA9 53.28,7.62; PA10 50.74,10.16; PA13 53.28,10.16; PA14 50.74,12.7; PA15 53.28,12.7; PB0 2.54,35.56; PB1 0,35.56; PB2 2.54,33.02; PB3 53.28,27.94; PB4 50.74,30.48; PB5 53.28,30.48; PB6 50.74,33.02; PB7 53.28,33.02; PB8 50.74,38.1; PB9 53.28,38.1; PB10 2.54,20.32; PB11 0,17.78; PB12 2.54,17.78; PB13 0,15.24; PB14 2.54,15.24; PB15 0,12.7; PC0 2.54,53.34; PC1 0,53.34; PC2 2.54,50.8; PC3 0,50.8; PC4 2.54,38.1; PC5 0,38.1; PC6 50.74,2.54; PC7 53.28,2.54; PC8 50.74,5.08; PC9 53.28,5.08; PC10 50.74,15.24; PC11 53.28,15.24; PC12 50.74,17.78; PC13 53.28,48.26; PC14 50.74,50.8; PC15 53.28,50.8; PD0 53.28,17.78; PD1 50.74,20.32; PD2 53.28,20.32; PD3 50.74,22.86; PD4 53.28,22.86; PD5 50.74,25.4; PD6 53.28,25.4; PD7 50.74,27.94; PD8 2.54,12.7; PD9 0,10.16; PD10 2.54,10.16; PD11 0,7.62; PD12 2.54,7.62; PD13 0,5.08; PD14 2.54,5.08; PD15 0,2.54; PE0 50.74,40.64; PE1 53.28,40.64; PE2 50.74,43.18; PE3 53.28,43.18; PE4 50.74,45.72; PE5 53.28,45.72; PE6 50.74,48.26; PE7 0,30.48; PE8 2.54,30.48; PE9 0,27.94; PE10 2.54,27.94; PE11 0,25.4; PE12 2.54,25.4; PE13 0,22.86; PE14 2.54,22.86; PE15 0,20.32; PH0 50.74,53.34; PH1 53.28,53.34; VDD 0,58.42; VDD2 2.54,58.42; VDD3 53.28,35.56
E5-6 = drill 0.813 pad 1.905: + -2.54,0 | drill 0.813 pad 1.905 octagon: - 2.54,0
E5-13 = drill 1.016 pad 2.54: + -2.54,0 | drill 1.016 pad 2.54 octagon: - 2.54,0
C5B3.5 = drill 0.813 pad 1.6 octagon: 1 -2.54,0; 2 2.54,0
C050-035X075 = drill 0.813 octagon: 1 -2.54,0; 2 2.54,0
C0805 = smd 1.3 x 1.5: 1 -0.95,0; 2 0.95,0
DIL08 = drill 0.813 pad 1.27 offset: 1 -3.81,-3.81; 2 -1.27,-3.81; 3 1.27,-3.81; 4 3.81,-3.81; 5 3.81,3.81; 6 1.27,3.81; 7 -1.27,3.81; 8 -3.81,3.81
TO220H = drill 1.118 long: 1 -2.54,-10.16; 2 0,-10.16; 3 2.54,-10.16 | hole 3.302: 0,4.826
CHIPLED_0805 = smd 1.2 x 1.2: A 0,-1.05; C 0,1.05
3RP/1610N = drill 2.032 pad 3.81 octagon: 1 -5,0; 2 0,0; 3 5,0
PJ-102A = drill 3 pad 4.8: RING 0.1,-3.39; RING_SW -4.6,-6.29; TIP 0.1,-9.29
0207/10 = drill 0.813 pad 1.422 long: 1 -5.08,0; 2 5.08,0
R0805 = smd 1.3 x 1.5: 1 -0.95,0; 2 0.95,0
EG1218 = drill 0.9 pad 1.676: O -2.54,0; P 0,0; S 2.54,0
SOT23-BEC = smd 1 x 1.4: B -0.95,-1.1; C 0,1.1; E 0.95,-1.1
PS603 = smd 5 x 3: 1 -4.184,-6.738; 2 4.184,-6.738

### Placement (x,y rotation side)
ADC_INPUT  78.11,114.94 180 top
BD1  59.69,91.76 180 top
C1  80.64,84.77 270 top
C2  66.36,107.63 90 top
C3  104.78,87.95 0 top
C4  100.65,99.69 90 top
C5  84.14,112.08 90 top
C6  27.62,109.17 90 top
C7  27.62,118.43 90 top
C8  33.97,103.5 90 top
C9  77.47,8.25 90 top
C10  80.33,93.34 270 top
C47  49.21,113.35 270 top
DAC_OUTPUT  90.81,114.94 180 top
IC1  91.76,87 0 top
IC2  45.4,101.28 0 top
IC6  10.48,112.98 90 top
LED1  82.55,67.63 270 top
LED2  82.64,64.45 270 top
LED3  82.64,61.28 270 top
LED4  82.64,58.1 270 top
LED5  82.64,54.93 270 top
LED6  82.64,48.58 270 top
LED7  82.64,45.4 270 top
LED8  82.64,42.23 270 top
LED9  82.64,39.05 270 top
LED10  82.64,35.88 270 top
LED11  87.09,67.63 270 top
LED12  87.09,64.45 270 top
LED13  87.09,61.28 270 top
LED14  87.09,58.1 270 top
LED15  87.09,54.93 270 top
LED16  87.09,48.58 270 top
LED17  87.09,45.4 270 top
LED18  87.09,42.23 270 top
LED19  87.09,39.05 270 top
LED20  87.09,35.88 270 top
LED21  91.53,67.63 270 top
LED22  91.53,64.45 270 top
LED23  91.53,61.28 270 top
LED24  91.53,58.1 270 top
LED25  91.53,54.93 270 top
LED26  91.53,48.58 270 top
LED27  91.53,45.4 270 top
LED28  91.53,42.23 270 top
LED29  91.53,39.05 270 top
LED30  91.53,35.88 270 top
LED31  99.16,67.63 270 top
LED32  99.16,64.45 270 top
LED33  99.16,61.28 270 top
LED34  99.16,58.1 270 top
LED35  99.16,54.93 270 top
LED36  99.16,48.58 270 top
LED37  99.16,45.4 270 top
LED38  99.16,42.23 270 top
LED39  99.16,39.05 270 top
LED40  99.16,35.88 270 top
LED41  103.6,67.63 270 top
LED42  103.6,64.45 270 top
LED43  103.6,61.28 270 top
LED44  103.6,58.1 270 top
LED45  103.6,54.93 270 top
LED46  103.6,48.58 270 top
LED47  103.6,45.4 270 top
LED48  103.6,42.23 270 top
LED49  103.6,39.05 270 top
LED50  103.6,35.88 270 top
LED51  108.05,67.63 270 top
LED52  108.05,64.45 270 top
LED53  108.05,61.28 270 top
LED54  108.05,58.1 270 top
LED55  108.05,54.93 270 top
LED56  108.05,48.58 270 top
LED57  108.05,45.4 270 top
LED58  108.05,42.23 270 top
LED59  108.05,39.05 270 top
LED60  108.05,35.88 270 top
LED61  115.67,67.63 270 top
LED62  115.67,64.45 270 top
LED63  115.67,61.28 270 top
LED64  115.67,58.1 270 top
LED65  115.67,54.93 270 top
LED66  115.67,48.58 270 top
LED67  115.67,45.4 270 top
LED68  115.67,42.23 270 top
LED69  115.67,39.05 270 top
LED70  115.67,35.88 270 top
LED71  120.11,67.63 270 top
LED72  120.11,64.45 270 top
LED73  120.11,61.28 270 top
LED74  120.11,58.1 270 top
LED75  120.11,54.93 270 top
LED76  120.11,48.58 270 top
LED77  120.11,45.4 270 top
LED78  120.11,42.23 270 top
LED79  120.11,39.05 270 top
LED80  120.11,35.88 270 top
LED81  124.56,67.63 270 top
LED82  124.56,64.45 270 top
LED83  124.56,61.28 270 top
LED84  124.56,58.1 270 top
LED85  124.56,54.93 270 top
LED86  124.56,48.58 270 top
LED87  124.56,45.4 270 top
LED88  124.56,42.23 270 top
LED89  124.56,39.05 270 top
LED90  124.56,35.88 270 top
LED91  132.18,67.63 270 top
LED92  132.18,64.45 270 top
LED93  132.18,61.28 270 top
LED94  132.18,58.1 270 top
LED95  132.18,54.93 270 top
LED96  132.18,48.58 270 top
LED97  132.18,45.4 270 top
LED98  132.18,42.23 270 top
LED99  132.18,39.05 270 top
LED100  132.18,35.88 270 top
LED101  136.62,67.63 270 top
LED102  136.62,64.45 270 top
LED103  136.62,61.28 270 top
LED104  136.62,58.1 270 top
LED105  136.62,54.93 270 top
LED106  136.62,48.58 270 top
LED107  136.62,45.4 270 top
LED108  136.62,42.23 270 top
LED109  136.62,39.05 270 top
LED110  136.62,35.88 270 top
LED111  141.06,67.63 270 top
LED112  141.06,64.45 270 top
LED113  141.06,61.28 270 top
LED114  141.06,58.1 270 top
LED115  141.06,54.93 270 top
LED116  141.06,48.58 270 top
LED117  141.06,45.4 270 top
LED118  141.06,42.23 270 top
LED119  141.06,39.05 270 top
LED120  141.06,35.88 270 top
LED121  149,67.63 270 top
LED122  149,64.45 270 top
LED123  149,61.28 270 top
LED124  149,58.1 270 top
LED125  149,54.93 270 top
LED126  149,48.58 270 top
LED127  149,45.4 270 top
LED128  149,42.23 270 top
LED129  149,39.05 270 top
LED130  149,35.88 270 top
LED131  153.76,67.63 270 top
LED132  153.76,64.45 270 top
LED133  153.76,61.28 270 top
LED134  153.76,58.1 270 top
LED135  153.76,54.93 270 top
LED136  153.76,48.58 270 top
LED137  153.76,45.4 270 top
LED138  153.76,42.23 270 top
LED139  153.76,39.05 270 top
LED140  153.76,35.88 270 top
LED141  158.21,67.63 270 top
LED142  158.21,64.45 270 top
LED143  158.21,61.28 270 top
LED144  158.21,58.1 270 top
LED145  158.21,54.93 270 top
LED146  158.21,48.58 270 top
LED147  158.21,45.4 270 top
LED148  158.21,42.23 270 top
LED149  158.21,39.05 270 top
LED150  158.21,35.88 270 top
POT0  151.86,6.67 0 top
POT1  131.22,6.98 0 top
POT2  111.22,6.98 0 top
POT3  90.58,6.98 0 top
POWER_JACK  40.32,122.55 0 top
R1  107,107 0 top
R2  82.87,78.42 180 top
R3  95.57,100.33 90 top
R4  72.71,68.58 0 top
R5  82.87,32.38 0 top
R6  87.31,32.38 0 top
R7  91.76,32.38 0 top
R8  99.38,32.38 0 top
R9  103.82,32.38 0 top
R10  108.27,32.38 0 top
R11  115.89,32.38 0 top
R12  120.33,32.38 0 top
R13  124.78,32.38 0 top
R14  132.4,32.38 0 top
R15  136.84,32.38 0 top
R16  140.97,32.38 0 top
R17  149.22,32.38 0 top
R18  153.99,32.38 0 top
R19  158.12,32.38 0 top
R20  72.71,65.41 0 top
R21  72.71,62.23 0 top
R22  72.71,59.05 0 top
R23  72.71,55.88 0 top
R24  72.71,49.53 0 top
R25  72.71,46.36 0 top
R26  72.71,43.18 0 top
R27  72.71,40 0 top
R28  72.71,36.83 0 top
R54  37.15,101.28 270 top
R55  53.34,101.28 90 top
RA  28.57,99.06 0 top
RB  14.92,99.06 0 top
SPEAKER  107.63,100.33 90 top
SPEAKER_SELECT  84.14,100.97 180 top
T1  77.79,67.63 270 top
T2  77.79,64.45 270 top
T3  77.79,61.28 270 top
T4  77.79,58.1 270 top
T5  77.79,54.93 270 top
T6  77.79,48.58 270 top
T7  77.79,45.4 270 top
T8  77.79,42.23 270 top
T9  77.79,39.05 270 top
T10  77.79,35.88 270 top
U$1  141.94,98.22 0 top
VOLUME  106.68,117.79 180 top

### Tracks (layer width: path | path; a pad name or v marks a point on that pad's centre or on a via)
+3V3  (via drill 0.35)
  Top 0.813: POT2.1 106.22,4.13 | 126.14,5.72 126.14,8.89 | 106.22,4.13 106.36,4.13 | 106.22,4.13 106.05,4.13 | T1.E 76.94,66.68 76.75,66.87 75.38,66.87 v75.25,66.99 | T2.E 76.37,63.82 v75.25,63.82 | T3.E 76.37,60.64 v75.25,60.64 | T4.E 76.37,57.47 v75.25,57.47 | T5.E v75.25,53.98 | T6.E 76.37,47.94 v75.25,47.94 | T7.E 76.37,44.77 v75.25,44.77 | T8.E 76.37,41.59 v75.25,41.59 | T9.E 76.37,38.42 v75.25,38.42 | T10.E v75.25,34.93
  Top 1.016: POT3.1 85.58,5.22 | 85.58,5.22 84.95,5.86 84.95,5.54 84.63,5.86 84.63,6.03 | 85.58,5.22 87,3.81 105.73,3.81 | 105.73,3.81 106.68,3.81 | 106.68,3.81 124.24,3.81 126.14,5.72 126.22,5.79 POT1.1 126.22,8.81 126.14,8.89 127.41,10.16 143.37,10.16 POT0.1 | 106.36,4.13 106.68,3.81 | POT2.1 106.22,4.3 106.05,4.13 105.73,3.81
  Top 1.27: BD1.3V BD1.3V2 21.59,35.88 47.94,9.52 v64.77,9.52 | v75.25,34.93 75.88,34.93 77.15,33.66 77.15,21.91 85.41,13.65 v85.41,12.38 | POT3.1 84.63,6.03 84.31,5.72 C9.+ 76.52,5.72 v74.3,7.94
  Bottom 1.27: v75.25,34.93 v75.25,38.42 v75.25,41.59 v75.25,44.77 v75.25,47.94 v75.25,53.98 v75.25,57.47 v75.25,60.64 v75.25,63.82 v75.25,66.99 | v74.3,7.94 72.71,9.52 v64.77,9.52 | v85.41,12.38 85.58,12.21 POT3.1
+5V
  Top 0.813: BD1.5V2 BD1.5V
  Top 1.016: C8.1 34.29,102.24
  Top 1.27: BD1.5V 9.53,33.34 | R54.2 29.84,96.2 28.57,97.47 28.57,102.24
  Top 1.8: BD1.5V 4.13,33.34 2.54,34.93 2.54,103.82 11.59,112.87 22.23,102.24 27.62,102.24 28.57,102.24 34.29,102.24 38.73,102.24 IC2.8
  Top 2: 11.59,112.87 14.24,115.52 IC6.3 27.26,115.52 C7.+
ADC_AUDIO_IN
  Top 0.813: RB.2 19.68,99.06
  Top 1.27: 21.91,97.47 RA.1 RB.2 20.32,99.06 21.91,97.47 | 21.91,97.47 21.91,82.23 50.48,53.66 BD1.PC4
COL_1  (via drill 0.35)
  Top 0.61: R5.1 v80.01,32.38
  Bottom 0.61: BD1.PC1 68.26,38.42 74.3,32.38 v80.01,32.38
COL_2  (via drill 0.35)
  Top 0.61: R6.1 86.36,31.75 85.72,31.11 v80.01,31.11
  Bottom 0.61: v80.01,31.11 73.66,31.11 67.63,37.15 59.05,37.15 58.42,37.78 58.42,39.69 BD1.PC2
COL_3  (via drill 0.35)
  Top 0.61: R7.1 90.81,31.11 89.54,29.85 v80.01,29.85 | v63.18,35.56 v63.18,39.69
  Bottom 0.61: v80.01,29.85 73.03,29.85 67.31,35.56 v63.18,35.56 | v63.18,39.69 63.18,52.7 62.23,53.66 BD1.PC5
COL_4  (via drill 0.35)
  Top 0.61: R8.1 98.43,30.16 96.84,28.58 v80.01,28.58 | v64.45,34.29 v64.45,39.69
  Bottom 0.61: v80.01,28.58 72.39,28.58 66.67,34.29 v64.45,34.29 | v64.45,39.69 64.45,54.93 63.18,56.2 BD1.PB1
COL_5  (via drill 0.35)
  Top 0.61: R9.1 102.87,30.16 100.02,27.3 v80.01,27.3 | BD1.PD2 7.68,72.71 11.43,72.71 25.72,58.42 25.72,54.61 v51.75,28.58 | v55.24,27.3 v64.77,27.3
  Bottom 0.61: v51.75,28.58 53.02,27.3 v55.24,27.3 | v64.77,27.3 v80.01,27.3
COL_6  (via drill 0.35)
  Top 0.61: R10.1 107.32,29.85 103.5,26.04 v80.01,26.04 | v65.72,26.04 v55.24,26.04 | v51.12,27.3 24.45,53.98 24.45,58.1 11.11,71.44 BD1.PD1
  Bottom 0.61: v55.24,26.04 52.39,26.04 v51.12,27.3 | v65.72,26.04 v80.01,26.04
COL_7  (via drill 0.35)
  Top 0.61: R11.1 114.94,26.04 113.67,24.76 v80.01,24.76 | v66.99,24.76 v56.2,24.76 | BD1.PD3 12.06,68.9 23.5,57.47 23.5,53.02 v50.16,26.35
  Bottom 0.61: v80.01,24.76 v66.99,24.76 | v56.2,24.76 51.75,24.76 v50.16,26.35
COL_8  (via drill 0.35)
  Top 0.61: R12.1 119.38,26.67 116.21,23.49 v80.01,23.49 | v68.26,23.49 v57.47,23.49 | v48.9,25.72 22.54,52.07 22.54,56.83 11.75,67.63 7.68,67.63 BD1.PD6
  Bottom 0.61: v80.01,23.49 v68.26,23.49 | v57.47,23.49 51.12,23.49 v48.9,25.72
COL_9  (via drill 0.35)
  Top 0.61: R13.1 123.83,26.67 119.38,22.23 v80.96,22.23 | v69.53,22.23 v58.74,22.23 | v47.62,25.08 21.27,51.43 21.27,56.52 12.7,65.09 7.68,65.09 BD1.PB3
  Bottom 0.61: v80.96,22.23 v69.53,22.23 | v58.74,22.23 50.48,22.23 v47.62,25.08
COL_10  (via drill 0.35)
  Top 0.61: R14.1 131.45,24.13 128.27,20.95 v81.6,20.95 | v70.8,20.95 v60.01,20.95 | v46.35,24.45 20,50.8 20,56.2 12.38,63.82 BD1.PD7
  Bottom 0.61: v81.6,20.95 v70.8,20.95 | v60.01,20.95 49.85,20.95 v46.35,24.45
COL_11  (via drill 0.35)
  Top 0.61: R15.1 135.89,24.13 131.45,19.68 v82.87,19.68 | v72.07,19.68 v61.28,19.68 | v45.09,23.81 18.73,50.17 18.73,55.88 13.34,61.28 BD1.PB4
  Bottom 0.61: v61.28,19.68 49.21,19.68 v45.09,23.81 | v82.87,19.68 v72.07,19.68
COL_12  (via drill 0.35)
  Top 0.61: R16.1 140.02,24.13 134.3,18.41 v84.14,18.41 | v73.03,18.41 v62.55,18.41 | v56.83,18.41 48.58,18.41 18.41,48.58 BD1.PE2
  Bottom 0.61: v84.14,18.41 v73.03,18.41 | v62.55,18.41 v56.83,18.41
COL_13  (via drill 0.35)
  Top 0.61: R17.1 148.28,23.81 141.61,17.14 v85.41,17.14 | v73.98,17.14 v63.82,17.14 | v58.1,17.14 47.94,17.14 19.05,46.04 BD1.PE4
  Bottom 0.61: v85.41,17.14 v73.98,17.14 | v63.82,17.14 v58.1,17.14
COL_14  (via drill 0.35)
  Top 0.61: R18.1 153.04,24.45 144.47,15.88 v86.68,15.88 | v74.93,15.88 v65.09,15.88 | v59.37,15.88 47.31,15.88 18.41,44.77 7.68,44.77 BD1.PE5
  Bottom 0.61: v86.68,15.88 v74.93,15.88 | v65.09,15.88 v59.37,15.88
COL_15  (via drill 0.35)
  Top 0.61: R19.1 157.16,24.13 147.64,14.6 v87.95,14.6 | BD1.PE6 17.78,43.5 46.67,14.6 v60.64,14.6 | v76.83,14.6 v66.04,14.6
  Bottom 0.61: v87.95,14.6 v76.83,14.6 | v66.04,14.6 v60.64,14.6
GND  (via drill 0.35)
  Top 1.016: C10.2 v80.33,91.12 | C8.2 v32.39,104.45 v32.38,104.46
  pour Bottom (isolate 0.813): 0,122.87 0,27.94 30.48,-2.54 168.28,-2.54 168.28,7.3 144.78,30.8 64.77,30.8 60.64,34.92 60.64,99.38 66.36,105.09 75.88,95.57 75.88,81.28 79.38,77.79 107.31,77.79 115.25,85.72 115.25,122.87
GUITAR_BUFFER
  Top 1.27: IC2.6 IC2.7 45.09,105.09 45.56,104.62 40.01,99.06 RA.2
N$1
  Top 0.813: LED1.C 83.69,67.32 LED2.C LED3.C LED4.C LED5.C LED6.C LED7.C LED8.C LED9.C LED10.C 83.82,35.76 R5.2
N$2
  Top 1.27: C5.2 84.14,116.52 87.63,120.02 99.46,120.02 VOLUME.3
N$3
  Top 0.813: LED11.C LED12.C LED13.C LED14.C LED15.C LED16.C LED17.C LED18.C LED19.C LED20.C 88.26,35.88 R6.2
N$4
  Top 0.813: LED21.C LED22.C LED23.C LED24.C LED25.C LED26.C LED27.C LED28.C LED29.C LED30.C 92.58,32.51 R7.2
N$5
  Top 0.813: LED31.C LED32.C LED33.C LED34.C LED35.C LED36.C LED37.C LED38.C LED39.C LED40.C 100.2,35.74 100.33,35.01 R8.2
N$6
  Top 0.813: LED41.C LED42.C LED43.C LED44.C LED45.C LED46.C LED47.C LED48.C LED49.C LED50.C 104.65,32.94 104.71,32.38 R9.2
N$7
  Top 0.813: LED51.C LED52.C LED53.C LED54.C LED55.C LED56.C LED57.C LED58.C LED59.C LED60.C 109.09,32.51 R10.2
N$8
  Top 0.813: LED61.C LED62.C LED63.C LED64.C LED65.C LED66.C LED67.C LED68.C LED69.C LED70.C 116.72,32.51 R11.2
N$9
  Top 0.813: LED71.C LED72.C LED73.C LED74.C LED75.C LED76.C LED77.C LED78.C LED79.C LED80.C 121.16,32.51 R12.2
N$10
  Top 0.813: LED81.C LED82.C LED83.C LED84.C LED85.C LED86.C LED87.C LED88.C LED89.C LED90.C 125.61,33.79 125.77,32.39 R13.2
N$11
  Top 0.813: LED91.C LED92.C LED93.C LED94.C LED95.C LED96.C LED97.C LED98.C LED99.C LED100.C 133.22,32.51 R14.2
N$12
  Top 0.813: LED101.C LED102.C LED103.C LED104.C LED105.C LED106.C LED107.C LED108.C LED109.C LED110.C 137.67,32.84 137.73,32.38 R15.2
N$13
  Top 0.813: LED111.C LED112.C LED113.C LED114.C LED115.C LED116.C LED117.C LED118.C LED119.C LED120.C 142.12,33.26 142.24,32.07 142.24,32.23 R16.2
N$14
  Top 0.813: LED121.C LED122.C LED123.C LED124.C LED125.C LED126.C LED127.C LED128.C LED129.C LED130.C 150.05,32.51 R17.2
N$15
  Top 0.813: LED131.C LED132.C LED133.C LED134.C LED135.C LED136.C LED137.C LED138.C LED139.C LED140.C 154.81,32.51 R18.2
N$16
  Top 0.813: LED141.C LED142.C LED143.C LED144.C LED145.C LED146.C LED147.C LED148.C LED149.C LED150.C 159.26,32.42 | 159.26,32.42 | 159.26,32.42 R19.2
N$17  (via drill 0.35)
  Top 0.813: v81.38,69.21 81.38,67.7 LED1.A T1.C | v156.94,69.21 156.94,67.78 LED141.A | LED131.A 152.72,67.95 152.46,68.94 v152.18,69.21 | v146.46,69.21 147.58,68.1 LED121.A | LED111.A 140.01,68.68 v139.48,69.21 | LED101.A 135.57,68.58 135.52,68.73 v135.03,69.21 | LED91.A 131.12,68.68 v130.59,69.21 | LED81.A 123.5,68.36 v122.65,69.21 | LED71.A 119.06,68.72 118.56,69.21 v118.52,69.21 | LED61.A 114.61,68.68 v114.08,69.21 | v106.46,69.21 107.09,68.58 107.09,67.73 LED51.A | LED41.A 102.65,67.73 102.65,68.58 v102.01,69.21 | LED31.A 97.89,67.7 97.89,68.9 v97.57,69.21 | v89.95,69.21 90.58,68.58 90.58,67.73 LED21.A | LED11.A 86.04,68.68 v85.5,69.21
  Bottom 0.813: v81.38,69.21 v85.5,69.21 v89.95,69.21 v97.57,69.21 v102.01,69.21 v106.46,69.21 v114.08,69.21 v118.52,69.21 v122.65,69.21 v130.59,69.21 v135.03,69.21 v139.48,69.21 v146.46,69.21 v152.18,69.21 v156.94,69.21
N$19
  Top 0.813: R25.2 T7.B
N$22
  Top 0.813: R26.2 T8.B
N$23  (via drill 0.35)
  Top 0.813: v81.69,46.99 81.59,46.89 LED7.A T7.C | v156.94,46.99 156.94,45.55 LED147.A | LED137.A 152.34,46.84 v152.5,46.99 | LED127.A 147.58,46.19 v146.78,46.99 | LED117.A 140.01,46.36 139.98,46.49 v139.48,46.99 | LED107.A 135.57,46.45 v135.03,46.99 | LED97.A 131.12,46.45 v130.59,46.99 | LED87.A 123.5,46.36 123.47,46.49 v122.97,46.99 | LED77.A 118.69,46.82 v118.52,46.99 | LED67.A 114.61,46.04 114.47,46.6 v114.08,46.99 | LED57.A 107,46.45 v106.46,46.99 | LED47.A 102.55,46.36 102.52,46.49 v102.01,46.99 | LED37.A 98.11,46.04 97.96,46.6 v97.57,46.99 | LED27.A 90.48,46.45 v89.95,46.99 | LED17.A 86.04,46.36 86,46.49 v85.5,46.99
  Bottom 0.813: v81.69,46.99 v85.5,46.99 v89.95,46.99 v97.57,46.99 v102.01,46.99 v106.46,46.99 v114.08,46.99 v118.52,46.99 v122.97,46.99 v130.59,46.99 v135.03,46.99 v139.48,46.99 v146.78,46.99 v152.5,46.99 v156.94,46.99
N$24  (via drill 0.35)
  Top 0.813: v81.69,43.81 81.69,43.71 81.59,43.68 LED8.A T8.C | v156.94,43.81 156.94,42.38 LED148.A | LED138.A 152.34,43.65 v152.18,43.81 | LED128.A 147.58,43.01 v146.78,43.81 | LED118.A 140.01,43.28 v139.48,43.81 | LED108.A 135.57,43.28 v135.03,43.81 | LED98.A 131.12,43.28 v130.59,43.81 | LED88.A 123.5,43.28 v122.97,43.81 | LED78.A 118.69,43.65 v118.52,43.81 | LED68.A 114.61,43.18 114.58,43.31 v114.08,43.81 | LED58.A 107,43.28 v106.46,43.81 | v102.33,43.81 102.55,43.6 LED48.A | LED38.A 98.11,43.28 v97.57,43.81 | LED28.A 90.48,43.28 v89.95,43.81 | LED18.A 86.04,43.28 v85.5,43.81
  Bottom 0.813: v81.69,43.81 v85.5,43.81 v89.95,43.81 v97.57,43.81 v102.33,43.81 v106.46,43.81 v114.08,43.81 v118.52,43.81 v122.97,43.81 v130.59,43.81 v135.03,43.81 v139.48,43.81 v146.78,43.81 v152.18,43.81 v156.94,43.81
N$25  (via drill 0.35)
  Top 0.813: v81.69,40.64 81.54,40.49 81.59,40.32 LED9.A T9.C | v156.94,40.64 156.94,39.2 LED149.A | LED139.A 152.34,40.47 v152.18,40.64 | LED129.A 147.58,39.84 v146.78,40.64 | v139.79,40.64 140.01,40.42 LED119.A | LED109.A 135.57,40.1 v135.03,40.64 | LED99.A 131.12,40.1 v130.59,40.64 | LED89.A 123.5,40.1 v122.97,40.64 | LED79.A 119.06,40.1 v118.52,40.64 | LED69.A 114.61,40.1 v114.08,40.64 | LED59.A 107,40.1 v106.46,40.64 | LED49.A 102.18,40.47 v102.01,40.64 | LED39.A 98.11,40.1 v97.57,40.64 | LED29.A 90.48,40.1 v89.95,40.64 | LED19.A 86.04,39.37 85.78,40.36 v85.5,40.64
  Bottom 0.813: v81.69,40.64 v85.5,40.64 v89.95,40.64 v97.57,40.64 v102.01,40.64 v106.46,40.64 v114.08,40.64 v118.52,40.64 v122.97,40.64 v130.59,40.64 v135.03,40.64 v139.79,40.64 v146.78,40.64 v152.18,40.64 v156.94,40.64
N$26  (via drill 0.35)
  Top 0.813: v81.38,37.46 81.55,37.29 81.59,37.1 LED10.A T10.C | v156.62,37.46 156.79,37.3 LED150.A | LED140.A 152.34,37.3 v152.18,37.46 | LED130.A 147.58,36.66 v146.78,37.46 | LED120.A 140.01,36.93 v139.48,37.46 | LED110.A 135.57,36.93 v135.03,37.46 | LED100.A 131.12,37.25 v130.91,37.46 | LED90.A 123.5,36.93 v122.97,37.46 | LED80.A 119.06,36.93 v118.52,37.46 | LED70.A 114.61,36.93 v114.08,37.46 | v106.78,37.46 107,37.25 LED60.A | LED50.A 102.55,36.51 102.4,37.07 v102.01,37.46 | LED40.A 98.11,36.93 v97.57,37.46 | LED30.A 90.48,36.19 90.22,37.19 v89.95,37.46 | LED20.A 86.04,36.93 v85.5,37.46
  Bottom 0.813: v81.38,37.46 v85.5,37.46 v89.95,37.46 v97.57,37.46 v102.01,37.46 v106.78,37.46 v114.08,37.46 v118.52,37.46 v122.97,37.46 v130.91,37.46 v135.03,37.46 v139.48,37.46 v146.78,37.46 v152.18,37.46 v156.62,37.46
N$27
  Top 1.27: C47.1 51.44,118.11 73.66,118.11 ADC_INPUT.2 | ADC_INPUT.2 76.83,115.57 | ADC_INPUT.2 76.83,104.2 SPEAKER_SELECT.S
N$28
  Top 1.27: SPEAKER_SELECT.O 89.53,103.82 DAC_OUTPUT.2
N$29
  Top 1.27: VOLUME.2 106.68,111.76 R1.1
N$30
  Top 1.27: IC1.3 93.03,80.96 95.25,78.74 107,78.74 112.39,84.14 112.39,106.68 R1.2
N$31
  Top 1.27: C1.+ 84.14,90.8 IC1.8
N$32
  Top 1.27: R2.1 IC1.1
N$33
  Top 1.27: C1.- 80.64,80.64 78.42,78.42 R2.2
N$34
  Top 1.27: R3.1 95.57,90.17
  Top 1.8: IC1.5 95.57,90.17 95.57,89.53 97.16,87.95 C3.+
N$35
  Top 1.8: 107.31,87.54 C3.- 107.31,98.74 SPEAKER.1
N$36
  Top 1.27: C4.2 98.74,102.24 R3.2
N$37
  Top 1.27: SPEAKER_SELECT.P C5.1
N$40
  Top 0.813: R4.2 T1.B
N$42  (via drill 0.35)
  Top 0.813: v81.38,66.04 81.59,65.82 LED2.A T2.C | v156.94,66.04 156.94,64.6 LED142.A | LED132.A 152.18,64.62 v152.18,66.04 | LED122.A 148.05,64.55 148.05,64.77 v146.78,66.04 | v139.48,66.04 140.11,65.41 140.11,64.55 LED112.A | LED102.A 135.67,64.55 135.67,65.41 v135.03,66.04 | v130.59,66.04 131.22,65.41 131.22,64.55 LED92.A | v122.97,66.04 123.6,65.41 123.6,64.55 LED82.A | LED72.A 119.06,65.5 v118.52,66.04 | LED62.A 114.61,65.5 v114.08,66.04 | LED52.A 107,65.5 v106.46,66.04 | LED42.A 102.55,65.5 v102.01,66.04 | LED32.A 98.11,65.5 v97.57,66.04 | v89.95,66.04 90.58,65.41 90.58,64.55 LED22.A | LED12.A 86.14,64.55 86.14,65.41 v85.5,66.04
  Bottom 0.813: v81.38,66.04 v85.5,66.04 v89.95,66.04 v97.57,66.04 v102.01,66.04 v106.46,66.04 v114.08,66.04 v118.52,66.04 v122.97,66.04 v130.59,66.04 v135.03,66.04 v139.48,66.04 v146.78,66.04 v152.18,66.04 v156.94,66.04
N$43
  Top 0.813: R20.2 T2.B
N$45  (via drill 0.35)
  Top 0.813: v81.38,62.87 81.59,62.64 LED3.A T3.C | v156.94,62.87 156.94,61.43 LED143.A | LED133.A 152.18,61.44 v152.18,62.87 | LED123.A 147.95,61.44 148.2,61.44 v146.78,62.87 | LED113.A 140.11,61.38 140.11,62.23 v139.48,62.87 | LED103.A 135.03,61.44 v135.03,62.87 | LED93.A 131.22,61.38 131.22,62.23 v130.59,62.87 | LED83.A 123.6,61.38 123.6,62.23 v122.97,62.87 | LED73.A 119.16,61.38 119.16,62.23 v118.52,62.87 | LED63.A 114.61,62.33 | 114.61,62.33 | 114.61,62.33 v114.08,62.87 | v106.46,62.87 107.09,62.23 107.09,61.38 LED53.A | LED43.A 102.65,61.38 102.65,62.23 v102.01,62.87 | v97.57,62.87 98.2,62.23 98.2,61.38 LED33.A | LED23.A 90.58,61.38 90.58,62.23 v89.95,62.87 | LED13.A 86.04,62.4 85.97,62.4 v85.5,62.87
  Bottom 0.813: v81.38,62.87 v85.5,62.87 v89.95,62.87 v97.57,62.87 v102.01,62.87 v106.46,62.87 v114.08,62.87 v118.52,62.87 v122.97,62.87 v130.59,62.87 v135.03,62.87 v139.48,62.87 v146.78,62.87 v152.18,62.87 v156.94,62.87
N$46
  Top 0.813: R21.2 T3.B
N$48  (via drill 0.35)
  Top 0.813: v81.38,59.69 81.59,59.47 LED4.A T4.C | v156.94,59.69 156.94,58.25 LED144.A | LED134.A 152.18,58.27 v152.18,59.69 | LED124.A 147.95,59.32 147.58,59.69 v147,59.69 | LED114.A 140.11,58.2 140.11,59.06 v139.48,59.69 | LED104.A 135.67,58.2 135.67,59.06 v135.03,59.69 | LED94.A 131.22,58.2 131.22,59.06 v130.59,59.69 | LED84.A 123.6,58.2 123.6,59.06 v122.97,59.69 | LED74.A 119.16,58.2 119.16,59.06 v118.52,59.69 | LED64.A 114.68,58.17 114.71,58.27 114.71,59.06 v114.08,59.69 | LED54.A 107.09,58.2 107.09,59.06 v106.46,59.69 | LED44.A 102.55,59.15 v102.01,59.69 | LED34.A 98.11,59.15 v97.57,59.69 | LED24.A 90.48,59.15 v89.95,59.69 | LED14.A 86.04,59.15 v85.5,59.69
  Bottom 0.813: v81.38,59.69 v85.5,59.69 v89.95,59.69 v97.57,59.69 v102.01,59.69 v106.46,59.69 v114.08,59.69 v118.52,59.69 v122.97,59.69 v130.59,59.69 v135.03,59.69 v139.48,59.69 v147,59.69 v152.18,59.69 v156.94,59.69
N$49
  Top 0.813: R22.2 T4.B
N$51  (via drill 0.35)
  Top 0.813: v81.38,56.52 v81.39,56.52 81.54,56.36 81.59,56.15 LED5.A T5.C | v156.94,56.52 156.94,55.08 LED145.A | v152.18,56.52 152.81,55.88 152.81,55.02 LED135.A | LED125.A 147.95,56.14 147.73,56.36 146.93,56.36 v146.78,56.52 | LED115.A 140.01,55.98 v139.48,56.52 | LED105.A 135.57,55.98 v135.03,56.52 | LED95.A 131.12,55.98 v130.59,56.52 | LED85.A 123.5,55.98 v122.97,56.52 | LED75.A 119.06,55.98 v118.52,56.52 | LED65.A 114.61,55.98 v114.08,56.52 | LED55.A 107,55.98 v106.46,56.52 | LED45.A 102.55,55.98 v102.01,56.52 | LED35.A 98.11,55.98 v97.57,56.52 | LED25.A 90.48,55.98 v89.95,56.52 | LED15.A 86.04,55.98 v85.5,56.52
  Bottom 0.813: v81.38,56.52 v85.5,56.52 v89.95,56.52 v97.57,56.52 v102.01,56.52 v106.46,56.52 v114.08,56.52 v118.52,56.52 v122.97,56.52 v130.59,56.52 v135.03,56.52 v139.48,56.52 v146.78,56.52 v152.18,56.52 v156.94,56.52
N$52
  Top 0.813: R23.2 T5.B
N$54  (via drill 0.35)
  Top 0.813: v81.38,49.85 81.38,48.73 LED6.A T6.C | v156.94,49.85 156.94,48.73 LED146.A | LED136.A 152.44,48.86 152.34,49.68 v152.18,49.85 | LED126.A 148.05,48.58 148.05,48.9 147.1,49.85 v146.78,49.85 | LED116.A 140.01,49.31 v139.48,49.85 | LED106.A 135.57,49.21 135.56,49.32 v135.03,49.85 | LED96.A 131.12,49.21 131.11,49.32 v130.59,49.85 | LED86.A 123.5,49.31 v122.97,49.85 | LED76.A 119.06,49.21 119.05,49.32 v118.52,49.85 | LED66.A 114.52,49.4 v114.08,49.85 | LED56.A 107,49.31 v106.46,49.85 | LED46.A 102.55,49.31 v102.01,49.85 | LED36.A 98.01,49.4 v97.57,49.85 | LED26.A 90.48,49.31 v89.95,49.85 | LED16.A 86.04,49.31 v85.5,49.85
  Bottom 0.813: v81.38,49.85 v85.5,49.85 v89.95,49.85 v97.57,49.85 v102.01,49.85 v106.46,49.85 v114.08,49.85 v118.52,49.85 v122.97,49.85 v130.59,49.85 v135.03,49.85 v139.48,49.85 v146.78,49.85 v152.18,49.85 v156.94,49.85
N$55
  Top 0.813: R24.2 T6.B
N$59
  Top 0.813: R27.2 T9.B
N$62
  Top 0.813: R28.2 T10.B
N$77
  Top 1.27: C47.2 49.21,110.17 | 49.21,110.17 49.21,108.58 | 49.21,108.58 49.21,107 | 49.21,107 IC2.5 | R55.2 53.34,107 51.75,108.58 50.8,108.58 | 49.21,108.58 50.8,108.58 | R54.1 39.37,108.58 47.62,108.58 | 49.21,108.58 47.62,108.58 | 47.62,108.58 arc-90 49.21,107 | 47.62,108.58 arc90 49.21,110.17 | 49.21,110.17 arc90 50.8,108.58 | 50.8,108.58 arc90 49.21,107
POT0
  Top 0.61: BD1.PA2 54.93,46.04 52.7,43.81 52.7,24.45 75.56,1.59 148.69,1.59 151.86,4.76 POT0.2
POT1
  Top 0.61: POT1.2 131.22,5.72 128.05,2.54 76.2,2.54 53.98,24.76 53.98,42.23 55.24,43.5 BD1.PA0
POT2
  Top 0.61: POT2.2 111.22,9.21 109.63,10.79 84.55,10.79 67.2,28.15 67.2,40.43 61.59,46.04 BD1.PA3
POT3
  Top 0.61: POT3.2 90.58,8.89 89.63,9.84 83.6,9.84 65.93,27.51 65.93,39.8 62.23,43.5 BD1.PA1
ROW_1
  Top 0.61: BD1.PD11 66.99,84.14 71.44,79.69 71.44,68.9 R4.1
ROW_2
  Top 0.61: BD1.PD10 58.42,82.87 66.67,82.87 70.48,79.06 70.48,66.36 71.44,65.41 R20.1
ROW_3
  Top 0.61: R21.1 71.12,62.23 69.53,63.82 69.53,78.1 66.04,81.6 BD1.PD9
ROW_4
  Top 0.61: BD1.PD8 58.42,77.79 66.36,77.79 68.58,75.56 68.58,60.96 70.48,59.06 R22.1
ROW_5
  Top 0.61: BD1.PB13 65.72,76.52 67.63,74.61 67.63,58.42 70.17,55.88 R23.1
ROW_6
  Top 0.61: BD1.PB14 58.42,75.25 64.45,75.25 66.67,73.02 66.67,52.07 69.22,49.53 R24.1
ROW_7
  Top 0.61: R25.1 69.85,46.36 65.72,50.49 65.72,72.07 63.82,73.98 BD1.PB11
ROW_8
  Top 0.61: BD1.PB12 58.42,72.71 63.18,72.71 64.77,71.12 64.77,49.21 70.8,43.18 R26.1
ROW_9
  Top 0.61: R27.1 63.82,47.95 63.82,69.85 62.23,71.44 BD1.PE15
ROW_10
  Top 0.61: BD1.PE13 62.23,68.9 62.87,68.26 62.87,46.67 71.76,37.78 R28.1
V+
  Top 1.016: C10.1 80.01,94.61 80.01,94.93
  Top 1.8: IC6.1 24.45,106.63 C6.+ 32.2,106.63 38.84,113.27 POWER_JACK.TIP 58.19,113.27 C2.+ | C2.+ 62.23,109.22 | C2.+ 66.99,105.09 77.15,94.93 80.01,94.93 91.12,94.93 93.03,93.03 IC1.6

### Text on the board
tNames: DIGITAL AUDIO EFFECT | (AOS PROJECT) | PCB designed by Generoso Imparato